# EAGLE design p_key (EAGLE 8.3.2)
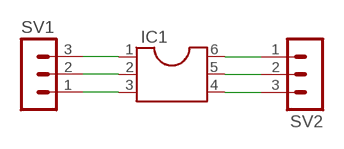
[diagram p0: schematic, sheet 1]

## Parts
IC1  DIL6  [DIL06]
SV1  MA03-1  [MA03-1]
SV2  MA03-1  [MA03-1]

## Nets
N$1: IC1.1 SV1.3
N$2: IC1.2 SV1.2
N$3: IC1.3 SV1.1
N$4: IC1.6 SV2.1
N$5: IC1.5 SV2.2
N$6: IC1.4 SV2.3

## Library data of the parts
IC1 = ic-package:DIL6: Dual In Line / Socket
SV1 SV2 = con-lstb:MA03-1: PIN HEADER; OC_FARNELL: unknown; OC_NEWARK: unknown

## Board
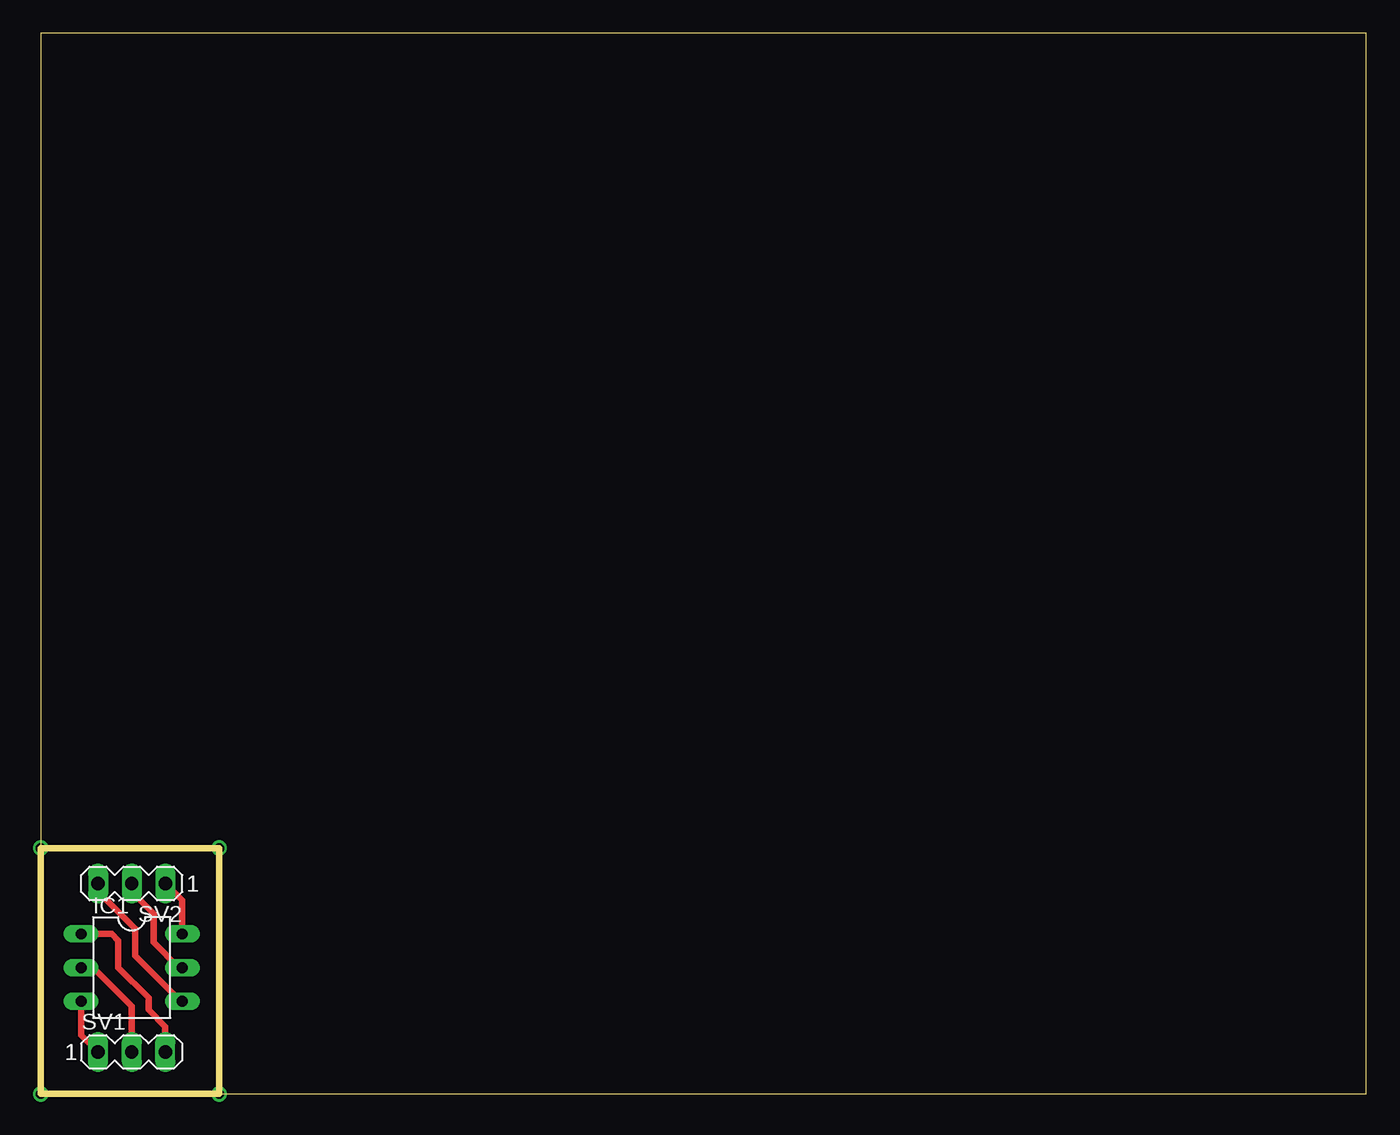
[diagram p1: board, top side]

Size 100 x 80 mm. Coordinates in mm from the lower left corner, seen from the top.
Outline: 0,0 100,0 100,80 0,80 0,0
Copper layers (1*16): Top 0.035mm / dielectric 1.5mm / Bottom 0.035mm
Design rules "default": minimum track width 6mil, minimum drill 0.35mm, track to track 6mil, track to pad 6mil, pad to pad 6mil, via to via 6mil, smd to smd 6mil, copper to edge 40mil, drill to drill 6mil, minimum pad ring 10mil, minimum via ring 8mil, stop-mask expansion 4mil, vias tented up to drill 0mil, thermal gap 10mil
Milling: 4 lines

### Footprints (pad centres in the part's own frame; a part is rotated, then mirrored left to right if it is on the bottom)
DIL06 = drill 0.813 long: 1 -2.54,-3.81; 2 0,-3.81; 3 2.54,-3.81; 4 2.54,3.81; 5 0,3.81; 6 -2.54,3.81
MA03-1 = drill 1.016 long: 1 -2.54,0; 2 0,0; 3 2.54,0

### Placement (x,y rotation side)
IC1  6.86,9.53 270 top
SV1  6.86,3.17 0 top
SV2  6.86,15.88 180 top

### Tracks (layer width: path | path; a pad name or v marks a point on that pad's centre or on a via)
N$1
  Top 0.508: IC1.1 5.33,12.06 5.84,11.56 5.84,9.53 8.13,7.24 8.13,6.35 9.4,5.08 SV1.3
N$2
  Top 0.508: IC1.2 3.94,9.53 6.86,6.6 SV1.2
N$3
  Top 0.508: IC1.3 3.05,4.45 SV1.1
N$4
  Top 0.508: IC1.6 10.67,14.61 SV2.1
N$5
  Top 0.508: IC1.5 10.41,9.53 8.51,11.43 8.51,13.59 6.86,15.24 SV2.2
N$6
  Top 0.508: IC1.4 10.54,6.99 7.11,10.41 7.11,12.45 4.32,15.24 SV2.3
N$7  (via drill 0.75)
  other vias: 0,0
N$8  (via drill 0.75)
  other vias: 13.46,0
N$9  (via drill 0.75)
  other vias: 13.46,18.54
N$10  (via drill 0.75)
  other vias: 0,18.54